# Altium schematic sheet Sheet1.SchDoc: *Mạch đo độ ẩm_LCD
size A4; Author: Nguyễn Trọng Phong; DrawnBy: Nguyễn Trọng Phong
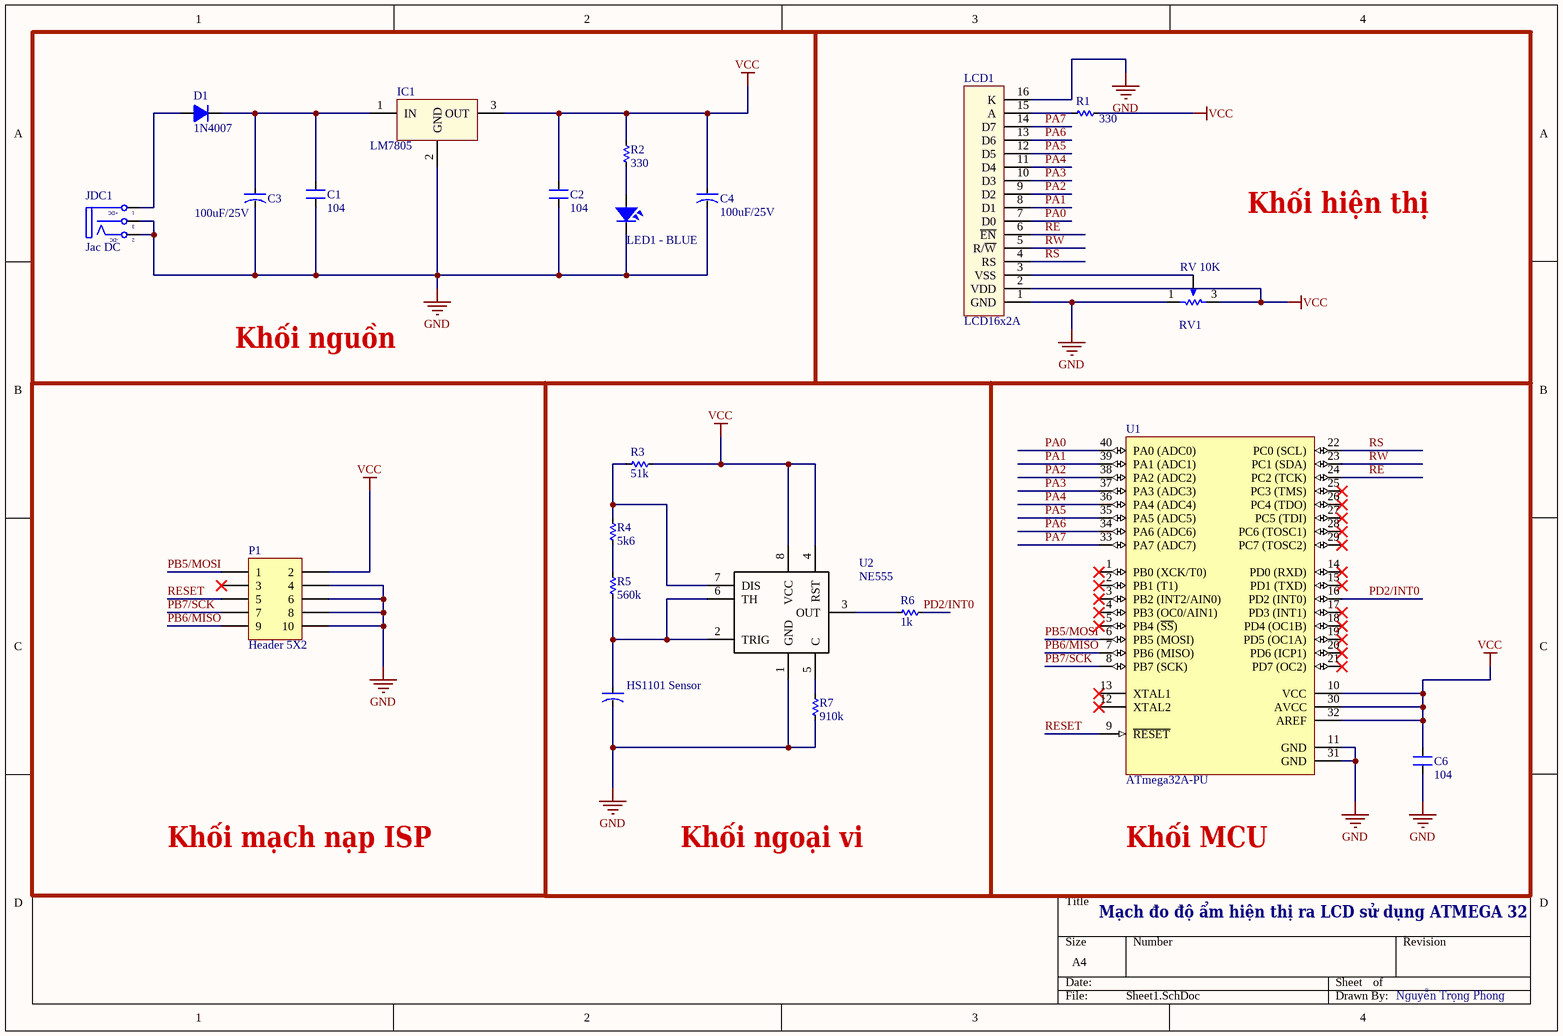
[diagram p0: Sheet1.SchDoc]

## Parts
C1  104  [CN2]
C2  104  [CN2]
C3  100uF/25V  [CA-ALU-2.54]
C4  100uF/25V  [CA-ALU-2.54]
C6  104  [CN2]
D1  1N4007  [D2A]
HS1101_Sensor  CN-ALU-DIP  [CA-ALU-5]  (value not drawn)
IC1  LM7805  [QTO-220H3]
JDC1  Jac DC  [DC-IN]
LCD1  LCD16x2A  [LCD16X2]
LED1_-_BLUE  LED  [LED-0805-Blue]  (value not drawn)
P1  Header 5X2  [HDR2X5_CEN]
R1  330  [RES-SMD-0805]
R2  330  [RES-SMD-0805]
R3  51k  [RES-SMD-0805]
R4  5k6  [RES-SMD-0805]
R5  560k  [RES-SMD-0805]
R6  1k  [RES-SMD-0805]
R7  910k  [RES-SMD-0805]
RV1  RV 10K  [RVAR10K]
U1  ATmega32A-PU  [DIP40/W0.6]
U2  NE555  [DIP8]

## Nets
GND: C1.1 C2.1 C3.2 C4.2 C6.1 HS1101_Sensor.2 IC1.2(GND) JDC1.2(TN) JDC1.3(S) LCD1.1(GND) LCD1.16(K) LED1_-_BLUE.2 P1.4 P1.6 P1.8 P1.10 R7.2 RV1.1 U1.11(GND) U1.31(GND) U2.1(GND)
VCC: C2.2 C4.1 C6.2 IC1.3(OUT) LCD1.2(VDD) P1.2 R1.2 R2.1 R3.2 RV1.3 U1.10(VCC) U1.30(AVCC) U1.32(AREF) U2.4(RST) U2.8(VCC)
PA0: LCD1.7(D0) U1.40(PA0_(ADC0))
PA1: LCD1.8(D1) U1.39(PA1_(ADC1))
PA2: LCD1.9(D2) U1.38(PA2_(ADC2))
PA3: LCD1.10(D3) U1.37(PA3_(ADC3))
PA4: LCD1.11(D4) U1.36(PA4_(ADC4))
PA5: LCD1.12(D5) U1.35(PA5_(ADC5))
PA6: LCD1.13(D6) U1.34(PA6_(ADC6))
PA7: LCD1.14(D7) U1.33(PA7_(ADC7))
PB5/MOSI: P1.1 U1.6(PB5_(MOSI))
PB6/MISO: P1.9 U1.7(PB6_(MISO))
PB7/SCK: P1.7 U1.8(PB7_(SCK))
PD2/INT0: R6.2 U1.16(PD2_(INT0))
RE: LCD1.6(~{EN}) U1.24(PC2_(TCK))
RESET: P1.5 U1.9(~{RESET})
RS: LCD1.4(RS) U1.22(PC0_(SCL))
RW: LCD1.5(R/~{W}) U1.23(PC1_(SDA))
NetC1_2: C1.2 C3.1 D1.2(K) IC1.1(IN)
NetD1_1: D1.1(A) JDC1.1(T)
NetHS1101_Sensor_1: HS1101_Sensor.1 R5.2 U2.2(TRIG) U2.6(TH)
NetLCD1_3: LCD1.3(VSS) RV1.2
NetLCD1_15: LCD1.15(A) R1.1
NetLED1_-_BLUE_1: LED1_-_BLUE.1 R2.2
NetR3_1: R3.1 R4.1 U2.7(DIS)
NetR4_2: R4.2 R5.1
NetR6_1: R6.1 U2.3(OUT)
NetR7_1: R7.1 U2.5(C)

Not connected (* = marked no-connect by the designer): P1 3*; U1 1(PB0_(XCK/T0))* 2(PB1_(T1))* 3(PB2_(INT2/AIN0))* 4(PB3_(OC0/AIN1))* 5(PB4_(~{SS}))* 12(XTAL2)* 13(XTAL1)* 14(PD0_(RXD))* 15(PD1_(TXD))* 17(PD3_(INT1))* 18(PD4_(OC1B))* 19(PD5_(OC1A))* 20(PD6_(ICP1))* 21(PD7_(OC2))* 25(PC3_(TMS))* 26(PC4_(TDO))* 27(PC5_(TDI))* 28(PC6_(TOSC1))* 29(PC7_(TOSC2))*

## Notes on the sheet
- Khối hiện thị
- Khối nguồn
- Khối mạch nạp ISP
- Khối ngoại vi
- Khối MCU
- Mạch đo độ ẩm hiện thị ra LCD sử dụng ATMEGA 32
- Nguyễn Trọng Phong
- (in symbol DCIN) +DC; -DC

## Library data of the parts
C1 C2 C6 = CN2: Cap np 104 => 105pF; Value: 0.1uF
C3 C4 HS1101_Sensor = CN-ALU-DIP: Capacitor (Semiconductor SIM Model); Value: 104; LatestRevisionDate: 17-Jul-2002; LatestRevisionNote: Re-released for DXP Platform.; PackageReference: C1206; Publisher: Altium Limited
D1 = D1A: Diode 1A; Value: 1N4007
IC1 = LM78xx: On ap +, from + 5 to + 24VDC; Value: LM7805
JDC1 = DCIN: Jac DC input; Value: Jac DC
LCD1 = LCD16x2: LCD dipslay 16 char, 2 line; Value: LCD16x2A
LED1_-_BLUE = LED SMD: Value: LED 3 - 5 ly 2 Colour
P1 = Header 5X2: Header, 5-Pin, Dual row; LatestRevisionDate: 17-Jul-2002; LatestRevisionNote: Re-released for DXP Platform.; Publisher: Altium Limited
R1-R7 = Res-SMD: Resistor; Manufacturer: Generic Components; Class: Passive; Published: 08/06/2000; Publisher: Altium Hobart Technology Centre
RV1 = Variable Resistor: Sim Note: Enter the Resistance value and the set point into parameter fields.; Set Position: 0.5; Published: 8-Jun-2000; LatestRevisionDate: 17-Jul-2002; LatestRevisionNote: Re-released for DXP Platform.; PackageReference: VR5; Publisher: Altium Limited
U1 = ATmega32A-PU: 8-Bit AVR Microcontroller with 32K Bytes of In-System Programmable Flash Memory; Published: 17-Sep-2003; DatasheetVersion: 2503C-AVR-10/02; PackageVersion: revB, Sep-2001; PackageReference: 40P6; Publisher: Altium Limited; PackageDescription: 40-lead (0.600"/15.24mm Wide) Plastic Dual Inline Package (PDIP); Supplier 1: Digi-Key; Supplier Part Number 1: ATMEGA32-16PC-ND; Supplier 2: Mouser; Supplier Part Number 2: 556-ATMEGA32-16PC; Code_JEDEC: MS-011-AC; ComponentLink1Description: Datasheet; ComponentLink1URL: http://www.atmel.com/dyn/resources/prod_documents/doc2503.pdf; ComponentLink2Description: Atmel.com Home; ComponentLink2URL: http://www.atmel.com
U2 = NE555: TIMER IC; Manufacturer Part Number: NE555DT; Manufacturer: STMicroelectronics; Frequency: 500kHz; Voltage - Supply: 4.5 V ~ 16 V; Current: 200mA; Supplier 1: Digi-Key; Supplier Part Number 1: 497-1962-2-ND; Supplier: Digi-Key; Category: Integrated Circuits (ICs); Supplier Part Number: 497-1962-2-ND; Package / Case: 8-SOIC (3.9mm Width); Packaging: Tape & Reel (TR); RoHS: RoHS Compliant; Operating Temperature: 0°C ~ 70°C; Count: -; Type: 555 Type, Timer/Oscillator (Single)